# Altium schematic sheet Power.SchDoc
size A4
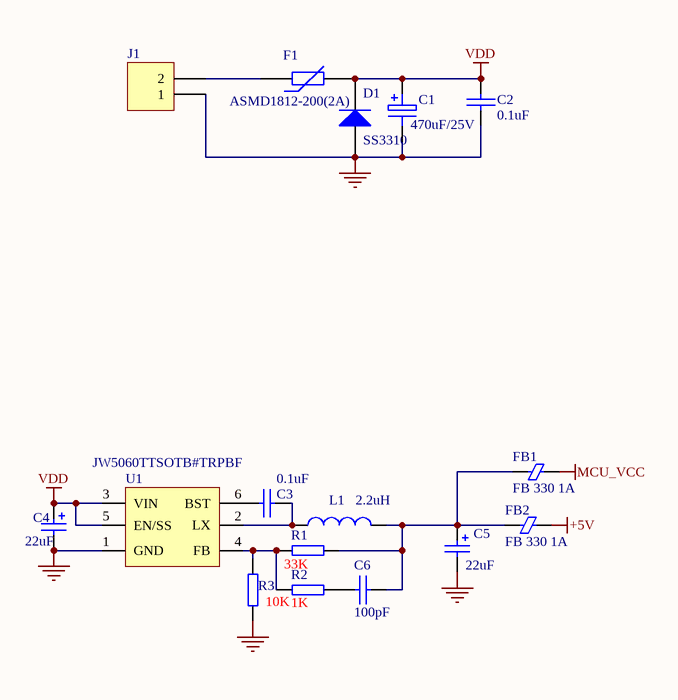
[diagram p0: Power.SchDoc]

## Parts
C1  470uF/25V  [TPC4-M]
C2  0.1uF  [C0603]
C3  0.1uF  [C0603]
C4  22uF  [C0603]
C5  22uF  [C0603]
C6  100pF  [C0603]
D1  SS3310  [SO-0.4]
F1  ASMD1812-200(2A)  [FS1812]
FB1  FB 330 1A  [R0603]
FB2  FB 330 1A  [R0603]
J1  Header 2  [JITE2_1]  (value not drawn)
L1  2.2uH  [2220]
R1  33K  [R0603]
R2  1K  [R0603]
R3  10K  [R0603]
U1  JW5060TTSOTB#TRPBF  [SOT23-6]

## Nets
+5V: FB2.2
GND: C1.2 C2.2 C4.2 C5.2 D1.A J1.1 R3.1 U1.1(GND)
MCU_VCC: FB1.2
VDD: C1.1 C2.1 C4.1 D1.K F1.2 U1.3(VIN) U1.5(EN/SS)
NetC3_1: C3.1 L1.1 U1.2(LX)
NetC3_2: C3.2 U1.6(BST)
NetC5_1: C5.1 C6.2 FB1.1 FB2.1 L1.2 R1.1
NetC6_1: C6.1 R2.1
NetF1_1: F1.1 J1.2
NetR1_2: R1.2 R2.2 R3.2 U1.4(FB)

## Library data of the parts
C1 = ELECTRO1: Electrolytic Capacitor; Value: 470uF/25V
C2 C3 C6 = CAP: Capacitor
  C2 C3: Value: 0.1uF
  C6: Value: 100pF
C4 C5 = Cap Pol2: Polarized Capacitor (Axial); Published: 8-Jun-2000; LatestRevisionDate: 17-Jul-2002; LatestRevisionNote: Re-released for DXP Platform.; PackageReference: POLAR0.8; Publisher: Altium Limited; Value: 22uF
D1 = Diode: Default Diode; Published: 8-Jun-2000; LatestRevisionDate: 17-Jul-2002; LatestRevisionNote: Re-released for DXP Platform.; PackageVersion: Sep-1996; PackageReference: SMC; Publisher: Altium Limited; PackageDescription: DO-214-AB/SMC; 2 C-Bend Leads; Body 7.9 x 5.9 mm, inc. leads (LxW); Code_JEDEC: DO-214-AB
F1 = Res Varistor: Varistor (Voltage-Sensitive Resistor); Published: 24-Mar-1999; LatestRevisionDate: 29-May-2009; LatestRevisionNote: IPC-7351 Footprint Added.; PackageVersion: Mar-2003; PackageReference: 6-0805; Publisher: Altium Limited; PackageDescription: Chip Resistor 0805 Case Size; Code_IPC: RESC2012
FB1 FB2 = FB: 磁珠电感100M
J1 = Header 2: Header, 2-Pin; LatestRevisionDate: 17-Jul-2002; LatestRevisionNote: Re-released for DXP Platform.; Publisher: Altium Limited
L1 = L: MS74-150MT; 型号: 2.2uH
R1-R3 = RES9: RES2
  R1: Value: 33K
  R2: Value: 1K
  R3: Value: 10K
U1 = XC9280